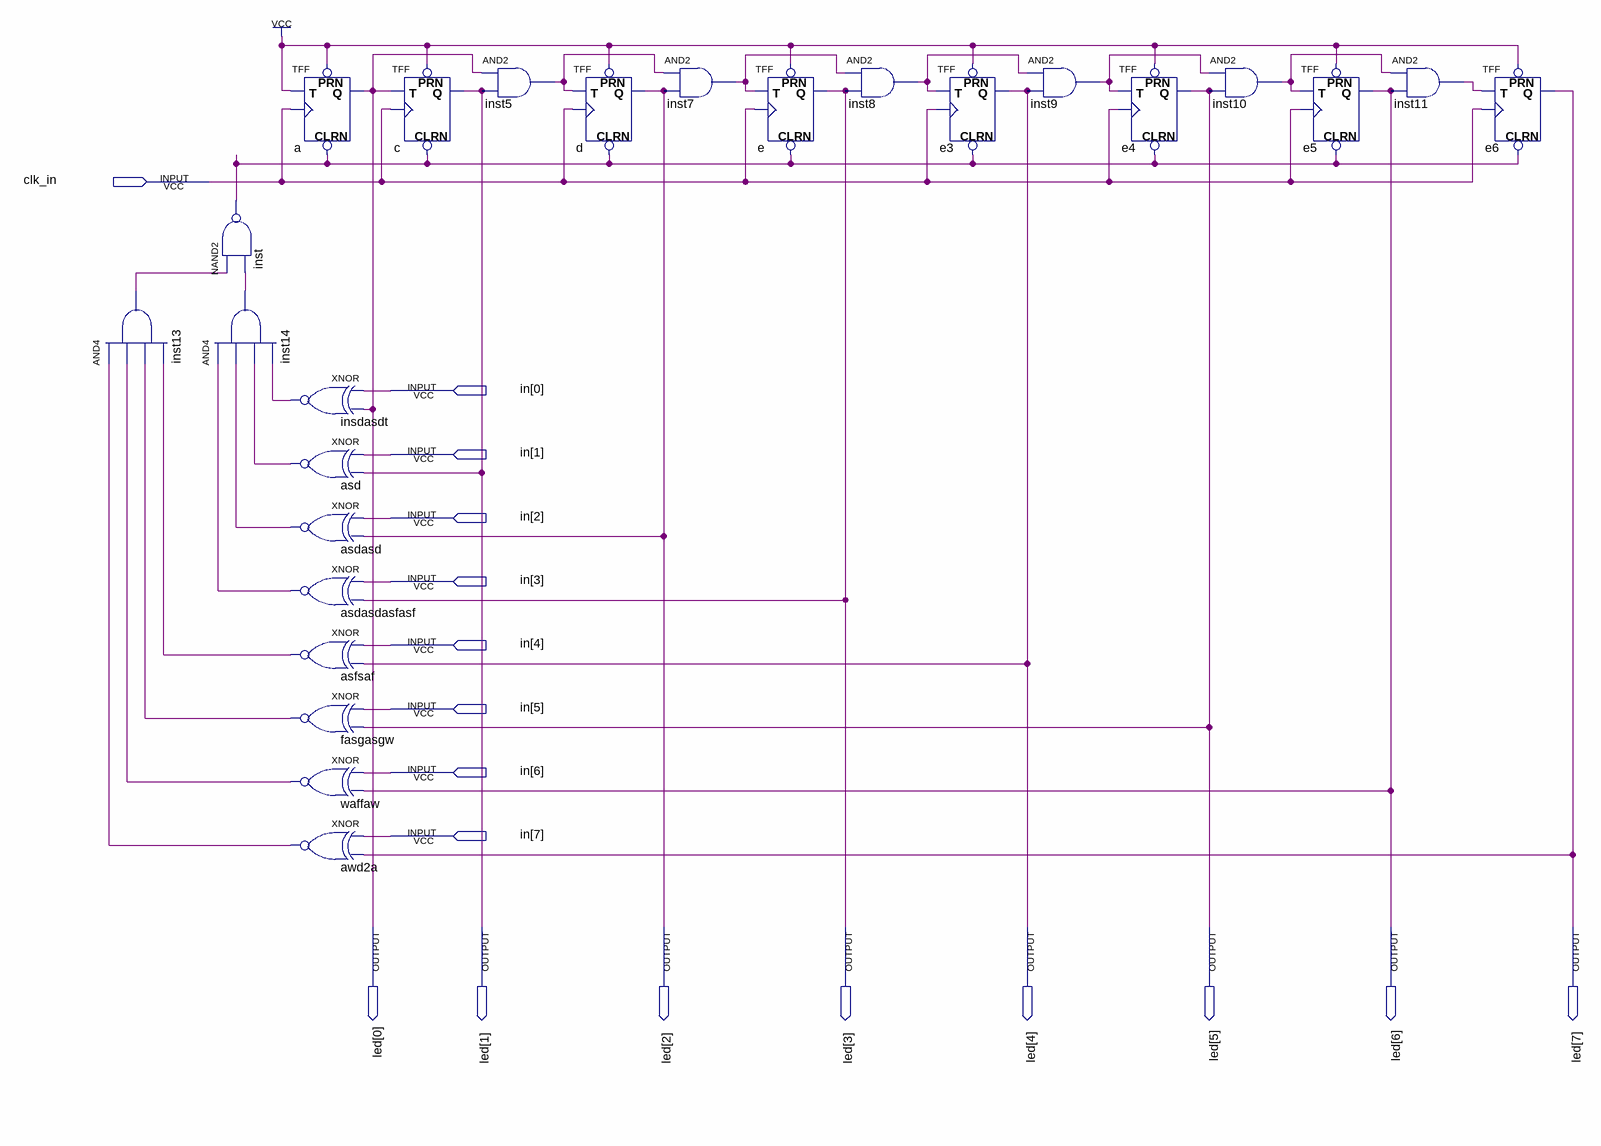
[diagram p0: schematic sheet]
// Quartus schematic contador_async_8bits.bdf as structural Verilog: 25 symbols, 17 pins
module contador_async_8bits (
  input  clk_in,
  input  [7:0] in,
  output [7:0] led
);

  wire asd_out, asdasd_out, asdasdasfasf_out, asfsaf_out, awd2a_out, fasgasgw_out, insdasdt_out, inst5_out,
       inst7_out, inst8_out, inst9_out, inst10_out, inst11_out, inst13_out, inst14_out, inst_out, waffaw_out;

  and inst13 (inst13_out, awd2a_out, waffaw_out, fasgasgw_out, asfsaf_out);
  nand inst (inst_out, inst13_out, inst14_out);
  and inst14 (inst14_out, asdasdasfasf_out, asdasd_out, asd_out, insdasdt_out);
  TFF a (.PRN(1'b1), .CLRN(inst_out), .T(1'b1), .CLK(clk_in), .Q(led[0]));
  xnor insdasdt (insdasdt_out, in[0], led[0]);
  xnor asd (asd_out, in[1], led[1]);
  xnor asdasd (asdasd_out, in[2], led[2]);
  xnor asdasdasfasf (asdasdasfasf_out, in[3], led[3]);
  xnor asfsaf (asfsaf_out, in[4], led[4]);
  xnor fasgasgw (fasgasgw_out, in[5], led[5]);
  xnor waffaw (waffaw_out, in[6], led[6]);
  xnor awd2a (awd2a_out, in[7], led[7]);
  TFF c (.PRN(1'b1), .CLRN(inst_out), .T(led[0]), .CLK(clk_in), .Q(led[1]));
  and inst5 (inst5_out, led[0], led[1]);
  TFF d (.PRN(1'b1), .CLRN(inst_out), .T(inst5_out), .CLK(clk_in), .Q(led[2]));
  and inst7 (inst7_out, inst5_out, led[2]);
  TFF e (.PRN(1'b1), .CLRN(inst_out), .T(inst7_out), .CLK(clk_in), .Q(led[3]));
  and inst8 (inst8_out, inst7_out, led[3]);
  TFF e3 (.PRN(1'b1), .CLRN(inst_out), .T(inst8_out), .CLK(clk_in), .Q(led[4]));
  and inst9 (inst9_out, inst8_out, led[4]);
  TFF e4 (.PRN(1'b1), .CLRN(inst_out), .T(inst9_out), .CLK(clk_in), .Q(led[5]));
  and inst10 (inst10_out, inst9_out, led[5]);
  TFF e5 (.PRN(1'b1), .CLRN(inst_out), .T(inst10_out), .CLK(clk_in), .Q(led[6]));
  and inst11 (inst11_out, inst10_out, led[6]);
  TFF e6 (.PRN(1'b1), .CLRN(inst_out), .T(inst11_out), .CLK(clk_in), .Q(led[7]));
endmodule
